# EasyEDA schematic Quadruped On Pico.json
TITLE: Quadrupedal Robot On Raspberry Pi Pico; REV: 1.0; Date: 2022-04-08; Sheet: 1/1
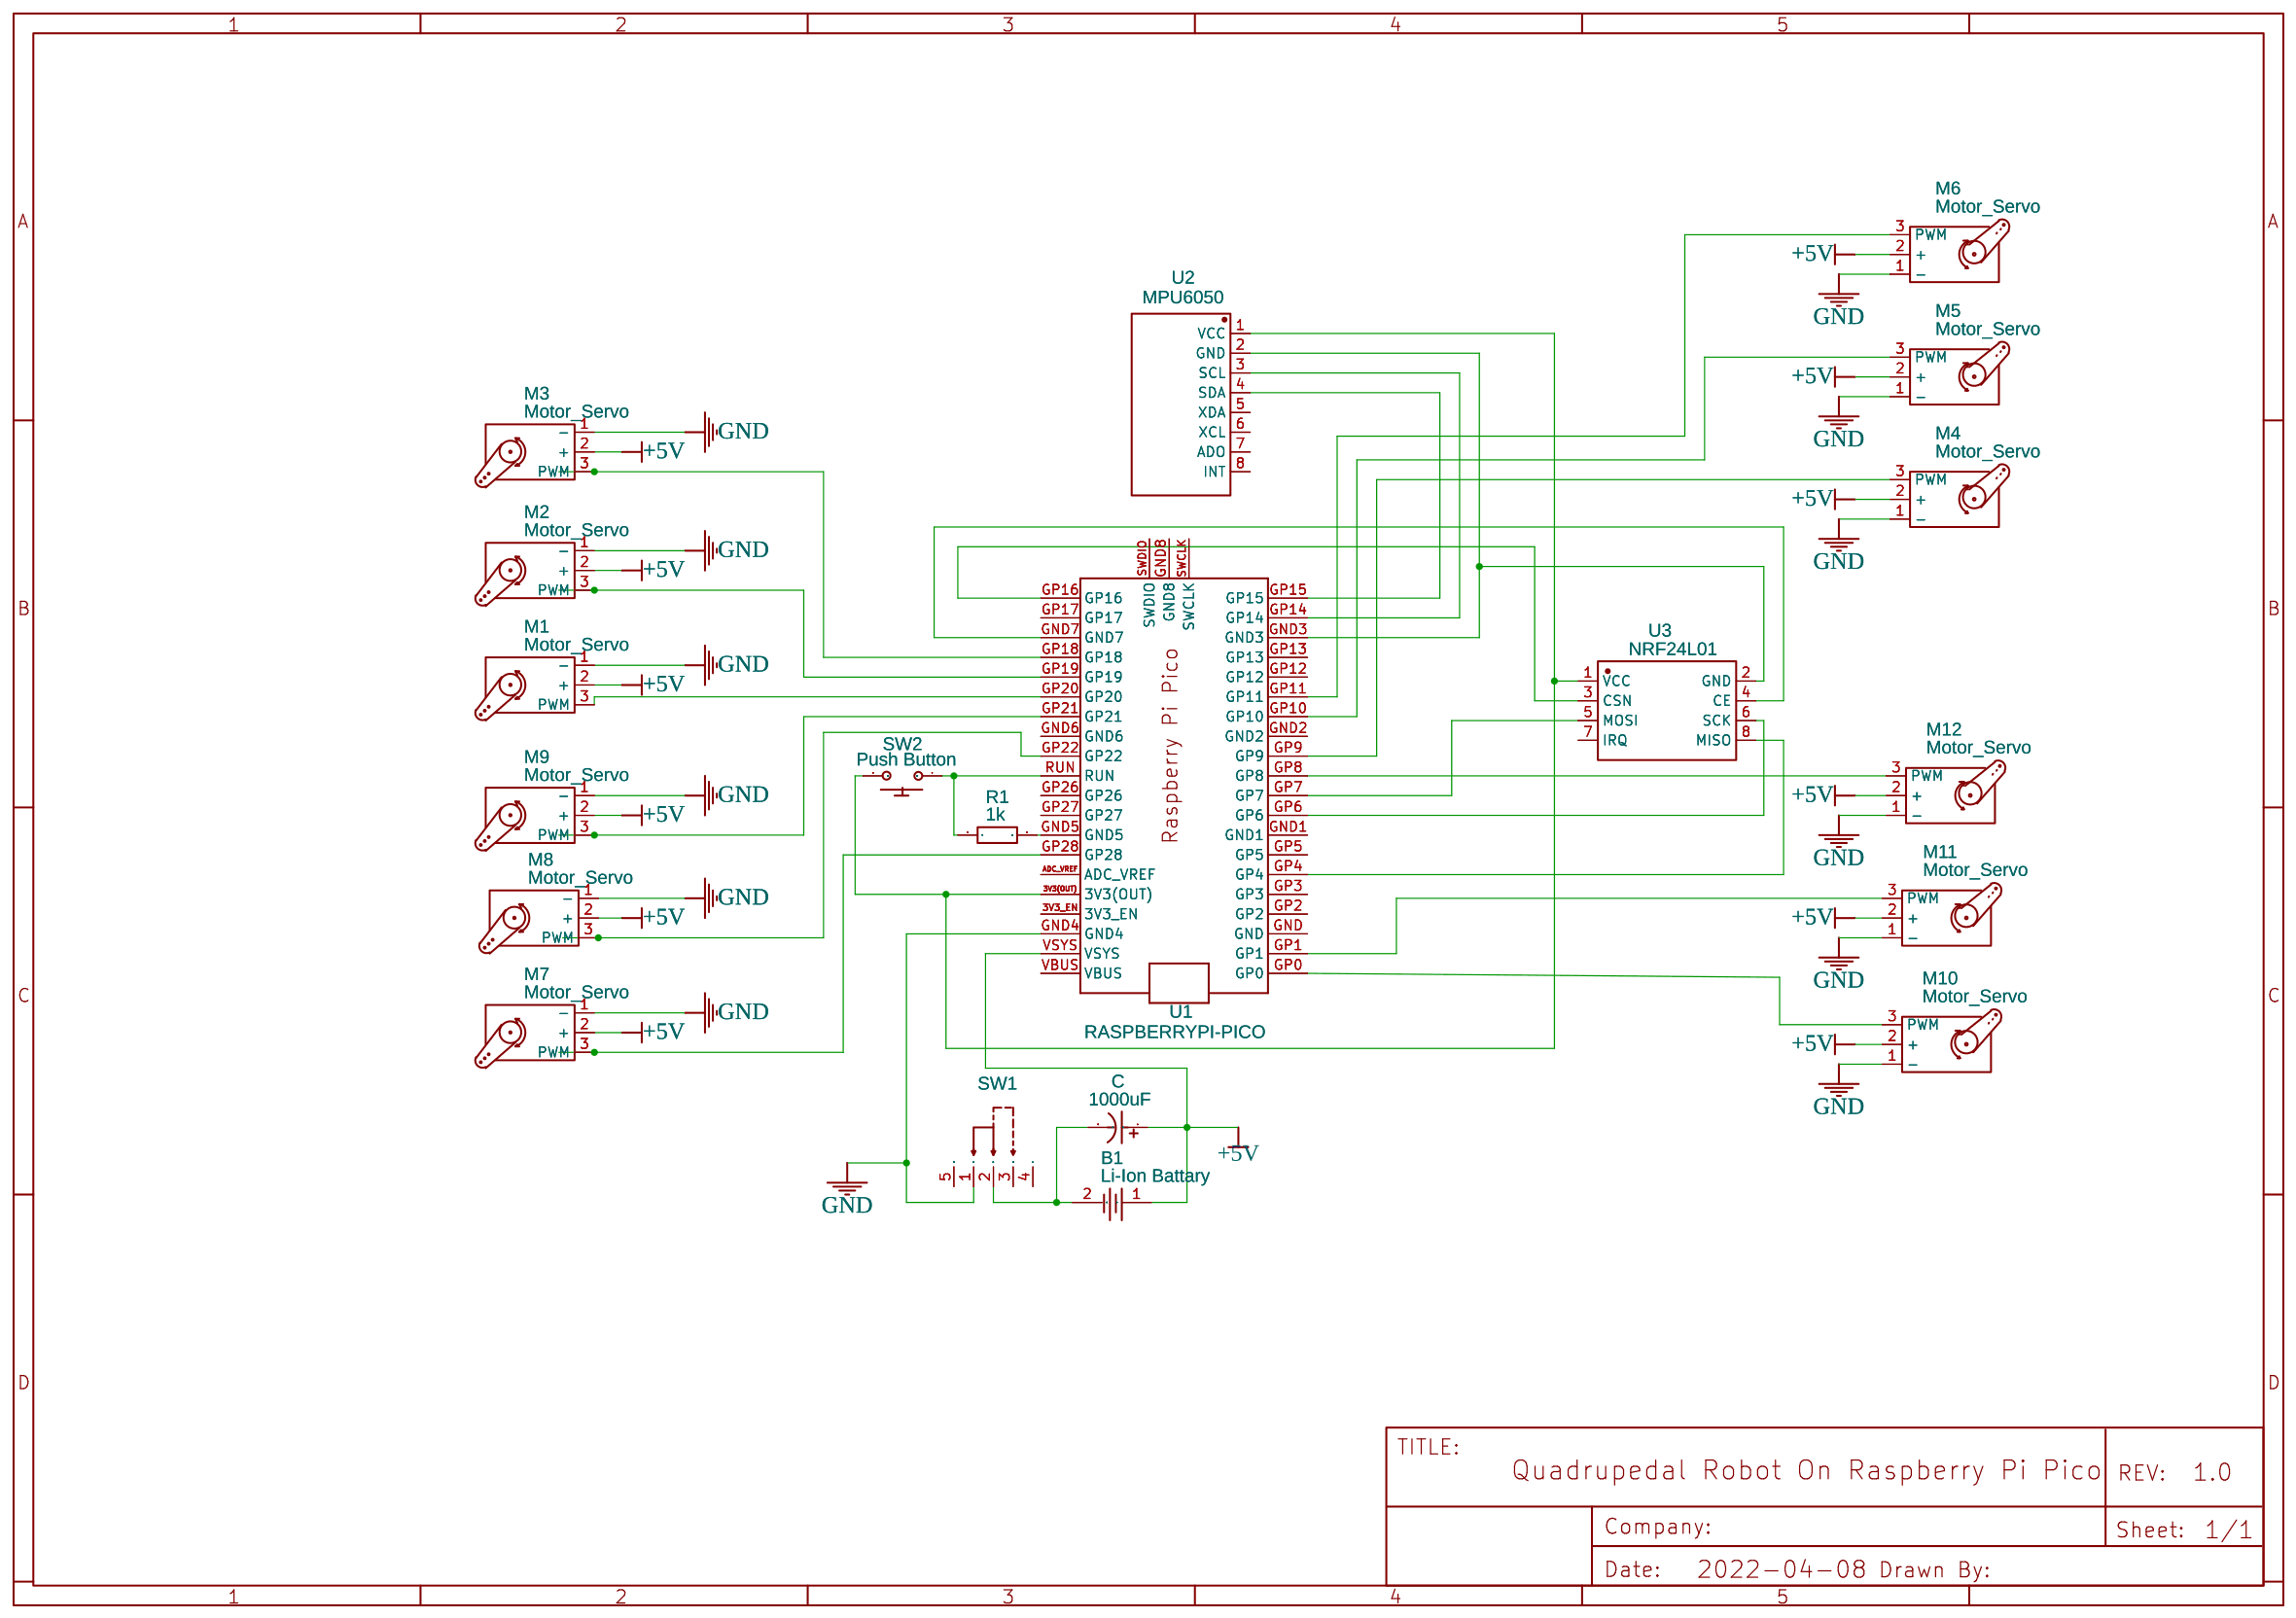
[diagram p0: schematic sheet]

## Parts
B1  Li-Ion Battary  [BATTARY-10]
C  1000uF  [CAP-TH_BD10.0-P5.00-D1.0-FD]
M1  Motor_Servo  [SERVOPINS]
M2  Motor_Servo  [SERVOPINS]
M3  Motor_Servo  [SERVOPINS]
M4  Motor_Servo  [SERVOPINS]
M5  Motor_Servo  [SERVOPINS]
M6  Motor_Servo  [SERVOPINS]
M7  Motor_Servo  [SERVOPINS]
M8  Motor_Servo  [SERVOPINS]
M9  Motor_Servo  [SERVOPINS]
M10  Motor_Servo  [SERVOPINS]
M11  Motor_Servo  [SERVOPINS]
M12  Motor_Servo  [SERVOPINS]
R1  1k  [JSCPCBLIB-RESISTOR-GENERIC]
SW1  SK-12F02-G030  [SW-TH_G-SWITCH_SK-12F02-G030]
SW2  Push Button  [SMD-BUTTON]
U1  RASPBERRYPI-PICO  [RASPBERRYPIPICO]
U2  MPU6050  [MPU6050]
U3  NRF24L01  [WIRELM-SMD_AI_NRF24L01]

## Library data of the parts
B1 = CR1220-2: Supplier: LCSC; Manufacturer: Q&J; image: //image.lceda.cn/szlcsc/C70381.jpg; Supplier Part: C70381; JLCPCB Part Class: Extended Part
C = 1000uF 16V 10*20: Supplier: LCSC; Manufacturer: ValuePro; Supplier Part: C43830; JLCPCB Part Class: Extended Part
M1 M3-M11 = Motor_Servo: Contributor: KiCAD; license: https://www.gnu.org/licenses/lgpl-2.1.html
M2 M12 = Motor_Servo: Contributor: KiCAD; license: https://www.gnu.org/licenses/lgpl-2.1.html; Package Display: No
R1 = 1K2-Metallfilm Widerstand: Supplier: Reichelt; Supplier Part: 9900001849626; Manufacturer: Yageo; Manufacturer Part: MF0207FTE52-0R; Contributor: jschnitzler; link: http://www.yageo.com/documents/recent/Yageo%20LR_FM0_2013.pdf
SW1 = SK-12F02-G030: Supplier: LCSC; Supplier Part: C2848892; Manufacturer: G-Switch(品赞); Contributor: LCSC
SW2 = Push Button: sourceId: M82WewO60; Supplier Part: COM-08720; Supplier: SparkFun
U1 = RASPBERRYPI-PICO COPY: Contributor: HelgeFH; Manufacturer Part: RASPBERRY PI PICO; Supplier: Element14; Supplier Part: 3643332; Manufacturer: Raspberry-PI; link: https://se.farnell.com/b/raspberry-pi
U2 = MPU6050: Supplier Part: GY521; Contributor: rahulaggarwal
U3 = NRF24L01: Supplier: LCSC; Manufacturer: Ai-Thinker; Manufacturer Part: NRF24L01+功率加强版绑定2.4Gwireless module; Supplier Part: C90751; JLCPCB Part Class: Extended Part

## Nets
+5V: B1.1 C.1 M1.2(+) M2.2(+) M3.2(+) M4.2(+) M5.2(+) M6.2(+) M7.2(+) M8.2(+) M9.2(+) M10.2(+) M11.2(+) M12.2(+) U1.VSYS
GND: M1.1(-) M2.1(-) M3.1(-) M4.1(-) M5.1(-) M6.1(-) M7.1(-) M8.1(-) M9.1(-) M10.1(-) M11.1(-) M12.1(-) SW1.1 U1.GND4
Net-(B1-2): B1.2 C.2 SW1.2
Net-(M1-3): M1.3(PWM) U1.GP20
Net-(M2-3): M2.3(PWM) U1.GP19
Net-(M3-3): M3.3(PWM) U1.GP18
Net-(M4-3): M4.3(PWM) U1.GP9
Net-(M5-3): M5.3(PWM) U1.GP10
Net-(M6-3): M6.3(PWM) U1.GP11
Net-(M7-3): M7.3(PWM) U1.GP28
Net-(M8-3): M8.3(PWM) U1.GP22
Net-(M9-3): M9.3(PWM) U1.GP21
Net-(M10-3): M10.3(PWM) U1.GP0
Net-(M11-3): M11.3(PWM) U1.GP1
Net-(M12-3): M12.3(PWM) U1.GP8
Net-(R1-1): R1.1 SW2.1(P$1) U1.RUN
Net-(R1-2): R1.2 U1.GND5
Net-(SW2-2): SW2.2(P$2) U1.3V3(OUT) U2.1(VCC) U3.1(VCC)
Net-(U1-GND3): U1.GND3 U2.2(GND) U3.2(GND)
Net-(U1-GND7): U1.GND7 U3.4(CE)
Net-(U1-GP4): U1.GP4 U3.8(MISO)
Net-(U1-GP6): U1.GP6 U3.6(SCK)
Net-(U1-GP7): U1.GP7 U3.5(MOSI)
Net-(U1-GP14): U1.GP14 U2.3(SCL)
Net-(U1-GP15): U1.GP15 U2.4(SDA)
Net-(U1-GP16): U1.GP16 U3.3(CSN)

Not connected (* = marked no-connect by the designer): SW1 3 4 5; U1 3V3_EN ADC_VREF GND GND1 GND2 GND6 GND8 GP2 GP3 GP5 GP12 GP13 GP17 GP26 GP27 SWCLK SWDIO VBUS; U2 5(XDA) 6(XCL) 7(ADO) 8(INT); U3 7(IRQ)
